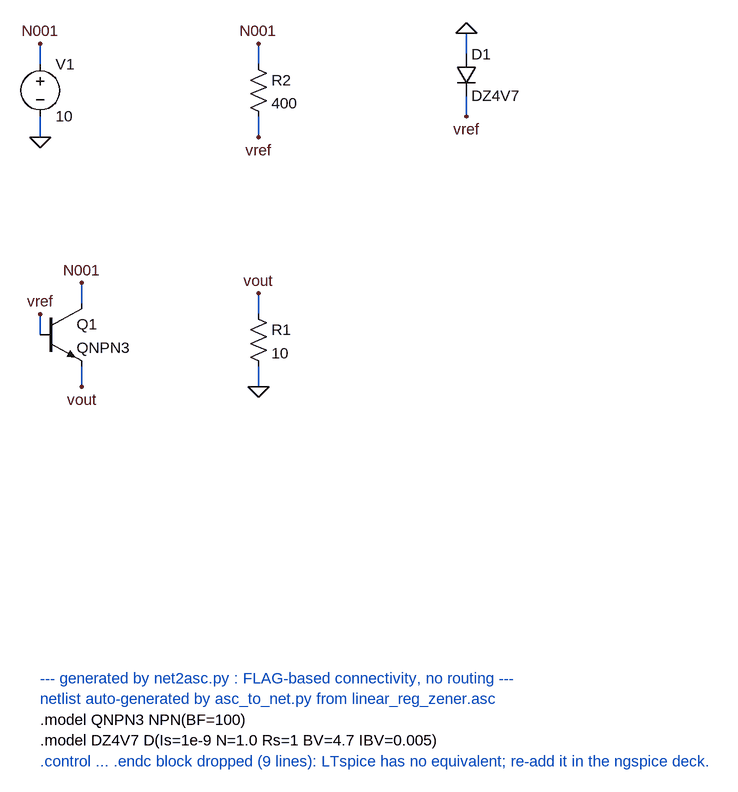
[diagram p0: schematic linear_reg_zener.asc]
linear_reg_zener.asc, the LTspice schematic file:
Version 4
SHEET 1 1056 1288
WIRE 0 16 0 -16
WIRE 0 96 0 128
WIRE 336 16 336 -16
WIRE 336 96 336 128
WIRE 656 0 656 -32
WIRE 656 64 656 96
WIRE 64 384 64 352
WIRE 0 432 0 400
WIRE 64 480 64 512
WIRE 336 400 336 368
WIRE 336 480 336 512
FLAG 0 -16 N001
FLAG 0 128 0
FLAG 336 -16 N001
FLAG 336 128 vref
FLAG 656 -32 0
FLAG 656 96 vref
FLAG 64 352 N001
FLAG 0 400 vref
FLAG 64 512 vout
FLAG 336 368 vout
FLAG 336 512 0
SYMBOL voltage 0 0 R0
SYMATTR InstName V1
SYMATTR Value 10
SYMBOL res 320 0 R0
SYMATTR InstName R2
SYMATTR Value 400
SYMBOL diode 640 0 R0
SYMATTR InstName D1
SYMATTR Value DZ4V7
SYMBOL npn 0 384 R0
SYMATTR InstName Q1
SYMATTR Value QNPN3
SYMBOL res 320 384 R0
SYMATTR InstName R1
SYMATTR Value 10
TEXT 0 960 Left 2 ;--- generated by net2asc.py : FLAG-based connectivity, no routing ---
TEXT 0 992 Left 2 ;netlist auto-generated by asc_to_net.py from linear_reg_zener.asc
TEXT 0 1024 Left 2 !.model QNPN3 NPN(BF=100)
TEXT 0 1056 Left 2 !.model DZ4V7 D(Is=1e-9 N=1.0 Rs=1 BV=4.7 IBV=0.005)
TEXT 0 1088 Left 2 ;.control ... .endc block dropped (9 lines): LTspice has no equivalent; re-add it in the ngspice deck.

The netlist it stands for:
* linear_reg_zener.asc
V1 N001 0 10
R2 N001 vref 400
D1 0 vref DZ4V7
Q1 N001 vref vout 0 QNPN3
R1 vout 0 10
.model D D
.lib standard.dio
.model NPN NPN
.model PNP PNP
.lib standard.bjt
* --- generated by net2asc.py : FLAG-based connectivity, no routing ---
* netlist auto-generated by asc_to_net.py from linear_reg_zener.asc
.model QNPN3 NPN(BF=100)
.model DZ4V7 D(Is=1e-9 N=1.0 Rs=1 BV=4.7 IBV=0.005)
* .control ... .endc block dropped (9 lines): LTspice has no equivalent; re-add it in the ngspice deck.
.backanno
.end